# Altium schematic sheet 9-123-305-Ivchenko.SCHDOC
size 420 x 297 mm; SheetNumber: 1; SheetTotal: 1; DocumentName: Sheet1.SCHDOC
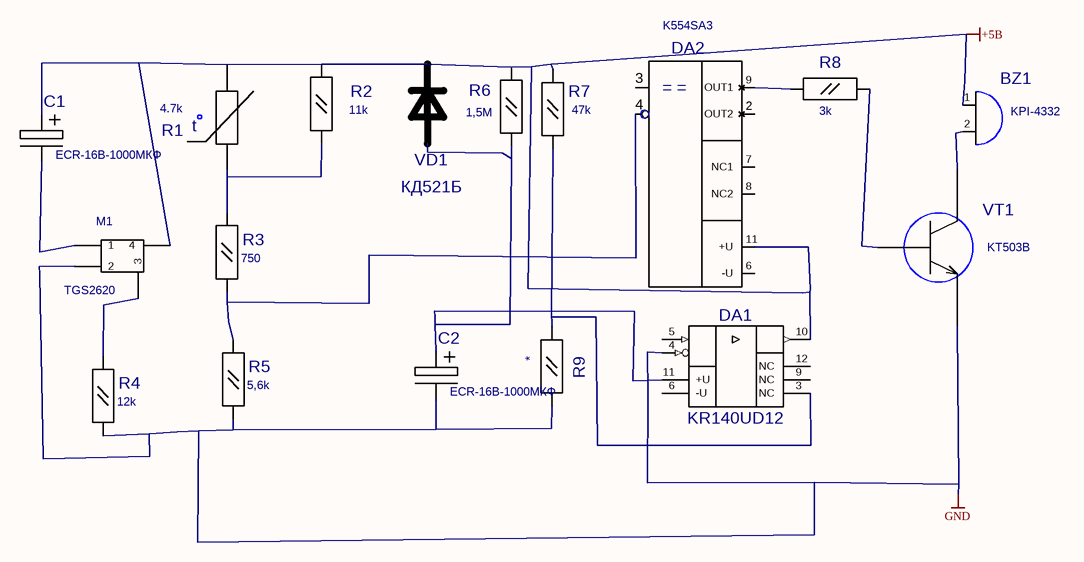
[diagram p0: 9-123-305-Ivchenko.SCHDOC]

## Parts
BZ1  value KPI-4332  [ZUM1]  (hidden comment: ZUM1)
C1  ECR-16В-1000МКФ  [ECR-16В-1000МКФ]
C2  ECR-16В-1000МКФ  [ECR-16В-1000МКФ]
DA1  KR140UD12  [201.14-1]
DA2  K554SA3  [DIP14]
M1  TGS2620  [GAS]
R1  value 4.7k  [B57861]  (hidden comment: B57861S0103F040)
R2  value 11k  [C2-33H-0.125W]  (hidden comment: C2-33H-0.125W_OLD_UGO)
R3  value 750  [C2-33H-0.125W]  (hidden comment: C2-33H-0.125W_OLD_UGO)
R4  value 12k  [C2-33H-0.125W]  (hidden comment: C2-33H-0.125W_OLD_UGO)
R5  value 5,6k  [C2-33H-0.125W]  (hidden comment: C2-33H-0.125W_OLD_UGO)
R6  value 1,5M  [C2-33H-0.125W]  (hidden comment: C2-33H-0.125W_OLD_UGO)
R7  value 47k  [C2-33H-0.125W]  (hidden comment: C2-33H-0.125W_OLD_UGO)
R8  value 3k  [C2-33H-0.125W]  (hidden comment: C2-33H-0.125W_OLD_UGO)
R9  C2-33H-0.125W_OLD_UGO  [C2-33H-0.125W]  (value not drawn)
VD1  КД521Б  [КД521(522)]
VT1  value KT503B  [TO-92-1]  (hidden comment: 2N4401)

## Nets
+5B: BZ1.1 C1.1 DA1.10(Q) DA2.11(+U) M1.4 R1.2 R2.1 R6.2 R7.1 VD1.2(K)
GND: C2.2 DA1.4(-I) M1.2 R4.2 R5.2 R9.2 VT1.1(E)
NetBZ1_2: BZ1.2 VT1.3(K)
NetC1_2: C1.2 M1.1
NetC2_1: C2.1 DA1.11(+U) R6.1 VD1.1(A)
NetDA1_3: DA1.3(NC) R7.2 R9.1
NetDA2_4: DA2.4(A1) R3.2 R5.1
NetDA2_9: DA2.9(OUT1) R8.1
NetM1_3: M1.3 R4.1
NetR1_1: R1.1 R2.2 R3.1
NetR8_2: R8.2 VT1.2(B)

Not connected (* = marked no-connect by the designer): DA1 1 2 5(+I) 6(-U) 7 8 9(NC) 12(NC) 13 14; DA2 1 2(OUT2) 3(A0) 5 6(-U) 7(NC1) 8(NC2) 10 12 13 14

## Notes on the sheet
- (in symbol B57861S0103F040) t

## Library data of the parts
R2-R9 = C2-33H-0.125W_OLD_UGO: Autor: pcbdesigner.ru
  R9: Value: *
C1 C2 = ECR-16В-1000МКФ: Value: *
DA1 = KR140UD12: Value: *
DA2 = K554SA3: Value: *
M1 = TGS2620: Value: *; ModifyDate: 12/17/2025 19:50:39
R1 = B57861S0103F040: Author: pcbdesigner.ru
VD1 = КД521Б: Value: *